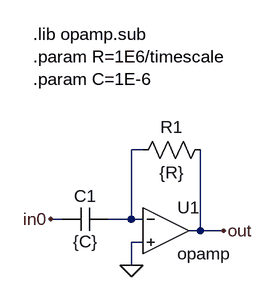
[diagram p0: schematic differentiator.asc]
differentiator.asc, the LTspice schematic file:
Version 4
SHEET 1 912 680
WIRE -752 0 -768 0
WIRE -864 96 -880 96
WIRE -768 96 -768 0
WIRE -768 96 -800 96
WIRE -752 96 -768 96
WIRE -672 112 -672 0
WIRE -672 112 -688 112
WIRE -640 112 -672 112
WIRE -752 128 -768 128
WIRE -768 160 -768 128
FLAG -880 96 in0
FLAG -640 112 out
FLAG -768 160 0
SYMBOL OpAmps/opamp -720 48 R0
SYMATTR InstName U1
SYMBOL res -656 -16 R90
WINDOW 0 0 56 VBottom 2
WINDOW 3 32 56 VTop 2
SYMATTR InstName R1
SYMATTR Value {R}
SYMBOL cap -800 80 R90
WINDOW 0 0 32 VBottom 2
WINDOW 3 32 32 VTop 2
SYMATTR InstName C1
SYMATTR Value {C}
TEXT -904 -160 Left 2 !.lib opamp.sub\n.param R=1E6/timescale\n.param C=1E-6

The netlist it stands for:
* differentiator.asc
XU1 N001 0 out opamp Aol=100K GBW=10Meg  ; pins invin noninvin out
R1 out N001 {R}
C1 N001 in0 {C}
.lib opamp.sub
.param R=1E6/timescale
.param C=1E-6
.backanno
.end